# EAGLE schematic lasersupply_smd (EAGLE 5.11)
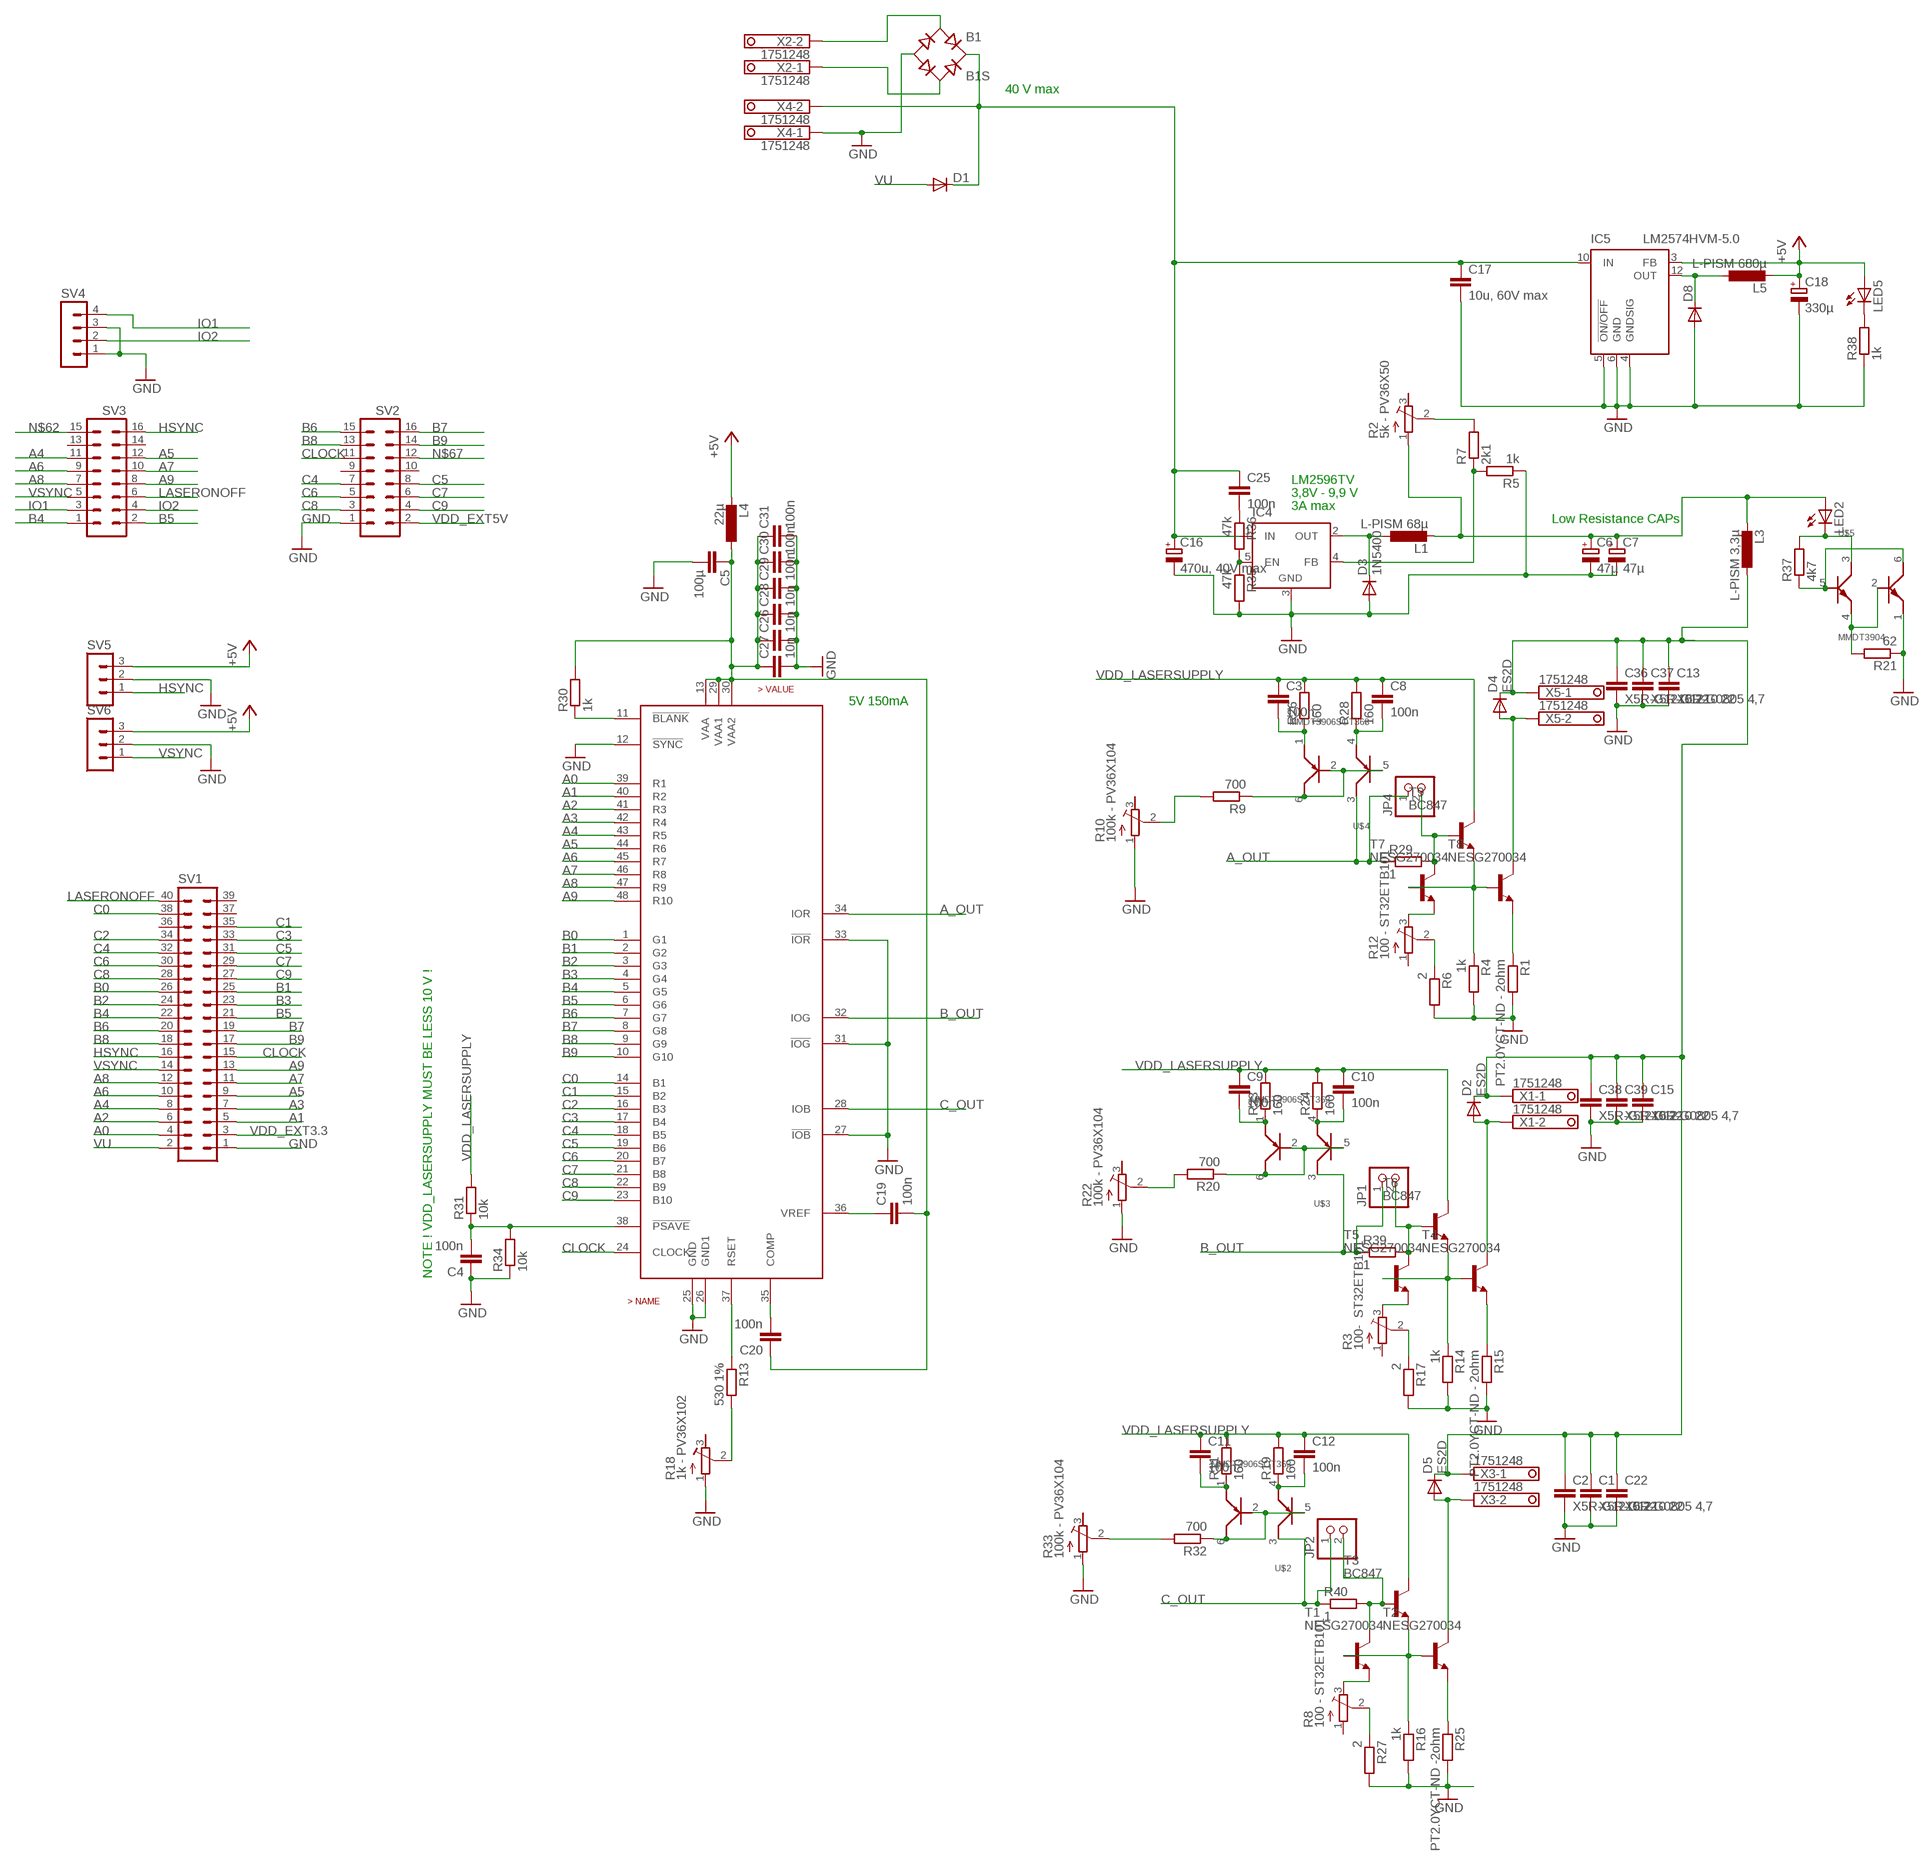
[diagram p0: schematic, sheet 1]

## Parts
B1  B1S  [MBS]
C1  X5R-G1210 22  C-EUC1210  [C1210]
C2  X5R-G1210 22  C-EUC1210  [C1210]
C3  100n  C-EUC0805  [C0805]
C4  100n  C-EUC0603  [C0603]
C5  100µ  C-EUC1210  [C1210]
C6  47µ  CPOL-EUD  [PANASONIC_D]
C7  47µ  CPOL-EUD  [PANASONIC_D]
C8  100n  C-EUC0805  [C0805]
C9  100n  C-EUC0805  [C0805]
C10  100n  C-EUC0805  [C0805]
C11  100n  C-EUC0805  [C0805]
C12  100n  C-EUC0805  [C0805]
C13  X5R-G0805 4,7  C-EUC0805  [C0805]
C15  X5R-G0805 4,7  C-EUC0805  [C0805]
C16  470u, 40V max  CPOL-EUD  [PANASONIC_D]
C17  10u, 60V max  C-EUC1210  [C1210]
C18  330µ  CPOL-EUD  [PANASONIC_D]
C19  100n  C-EUC0603  [C0603]
C20  100n  C-EUC0603  [C0603]
C22  X5R-G0805 4,7  C-EUC0805  [C0805]
C25  100n  C-EUC0805  [C0805]
C26  10n  C-EUC0603  [C0603]
C27  10n  C-EUC0603  [C0603]
C28  10n  C-EUC0603  [C0603]
C29  100n  C-EUC0603  [C0603]
C30  100n  C-EUC0603  [C0603]
C31  100n  C-EUC0603  [C0603]
C36  X5R-G1210 22  C-EUC1210  [C1210]
C37  X5R-G1210 22  C-EUC1210  [C1210]
C38  X5R-G1210 22  C-EUC1210  [C1210]
C39  X5R-G1210 22  C-EUC1210  [C1210]
D1  DIODE-SMB  [SMB]
D2  ES2D  DIODE-SOD323-R  [SOD323-R]
D3  1N5400  DIODE-SMC  [SMC]
D4  ES2D  DIODE-SOD323-R  [SOD323-R]
D5  ES2D  DIODE-SOD323-R  [SOD323-R]
D8  DIODE-SMB  [SMB]
IC4  LM2596TV  [TO220-51]
IC5  LM2574HVM-5.0  [SO14W]
JP1  PINHD-1X2  [1X02]
JP2  PINHD-1X2  [1X02]
JP4  PINHD-1X2  [1X02]
L1  L-PISM 68µ  L-EUPISM  [PISM]
L3  L-PISM 3,3µ  L-EUPIS28XX  [PIS28XX]
L4  22µ  L-EUPIS24XX  [PIS24XX]
L5  L-PISM 680µ  L-EUPISM  [PISM]
LED2  LEDCHIPLED_1206  [CHIPLED_1206]
LED5  LEDCHIPLED_1206  [CHIPLED_1206]
R1  PT2.0YCT-ND - 2ohm  R-EU_R2512  [R2512]
R2  5k - PV36X50  R-TRIMM64X  [RTRIM64X]
R3  100- ST32ETB101  TRIM_EU-SM-42/43A  [SM-42/43A]
R4  1k  R-EU_M0805  [M0805]
R5  1k  R-EU_M0805  [M0805]
R6  2  R-EU_M0805  [M0805]
R7  2k1  R-EU_M0805  [M0805]
R8  100 - ST32ETB101  TRIM_EU-SM-42/43A  [SM-42/43A]
R9  700  R-EU_M0805  [M0805]
R10  100k - PV36X104  R-TRIMM64X  [RTRIM64X]
R11  160  R-EU_R0805  [R0805]
R12  100 - ST32ETB101  TRIM_EU-SM-42/43A  [SM-42/43A]
R13  530 1%  R-EU_M0805  [M0805]
R14  1k  R-EU_M0805  [M0805]
R15  PT2.0YCT-ND - 2ohm  R-EU_R2512  [R2512]
R16  1k  R-EU_M0805  [M0805]
R17  2  R-EU_M0805  [M0805]
R18  1k - PV36X102  R-TRIMM64X  [RTRIM64X]
R19  160  R-EU_R0805  [R0805]
R20  700  R-EU_M0805  [M0805]
R21  62  R-EU_M0805  [M0805]
R22  100k - PV36X104  R-TRIMM64X  [RTRIM64X]
R23  160  R-EU_R0805  [R0805]
R24  160  R-EU_R0805  [R0805]
R25  PT2.0YCT-ND -2ohm  R-EU_R2512  [R2512]
R26  160  R-EU_R0805  [R0805]
R27  2  R-EU_R0805  [R0805]
R28  160  R-EU_R0805  [R0805]
R29  1  R-EU_R0805  [R0805]
R30  1k  R-EU_M0805  [M0805]
R31  10k  R-EU_M0805  [M0805]
R32  700  R-EU_M0805  [M0805]
R33  100k - PV36X104  R-TRIMM64X  [RTRIM64X]
R34  10k  R-EU_M0805  [M0805]
R35  47k  R-EU_M0805  [M0805]
R36  47k  R-EU_M0805  [M0805]
R37  4k7  R-EU_M0805  [M0805]
R38  1k  R-EU_M0805  [M0805]
R39  1  R-EU_R0805  [R0805]
R40  1  R-EU_R0805  [R0805]
SV1  ML40L  [ML40L]
SV2  MA08-2  [MA08-2]
SV3  MA08-2  [MA08-2]
SV4  MA04-1  [MA04-1]
SV5  MA03-1  [MA03-1]
SV6  MA03-1  [MA03-1]
T1  NESG270034  [SOT89-CEB]
T2  NESG270034  [SOT89-CEB]
T3  BC847  [SOT23]
T4  NESG270034  [SOT89-CEB]
T5  NESG270034  [SOT89-CEB]
T6  BC847  [SOT23]
T7  NESG270034  [SOT89-CEB]
T8  NESG270034  [SOT89-CEB]
T9  BC847  [SOT23]
U$1  ADV7123  [LQFP48]
U$2  MMDT3906SOT363  [SOT363_PHILIPS]
U$3  MMDT3906SOT363  [SOT363_PHILIPS]
U$4  MMDT3906SOT363  [SOT363_PHILIPS]
U$5  MMDT3904  [SOT363_PHILIPS]
X1  1751248  [1751248]
X2  1751248  [1751248]
X3  1751248  [1751248]
X4  1751248  [1751248]
X5  1751248  [1751248]

## Nets
+5V: C18.+ IC5.3(FB) L4.1 L5.2 LED5.A SV5.3 SV6.3
A0: SV1.4 U$1.39(R1)
A1: SV1.5 U$1.40(R2)
A2: SV1.6 U$1.41(R3)
A3: SV1.7 U$1.42(R4)
A4: SV1.8 SV3.11 U$1.43(R5)
A5: SV1.9 SV3.12 U$1.44(R6)
A6: SV1.10 SV3.9 U$1.45(R7)
A7: SV1.11 SV3.10 U$1.46(R8)
A8: SV1.12 SV3.7 U$1.47(R9)
A9: SV1.13 SV3.8 U$1.48(R10)
A_OUT: JP4.1 R29.1 U$1.34(IOR) U$4.3(C1)
B0: SV1.26 U$1.1(G1)
B1: SV1.25 U$1.2(G2)
B2: SV1.24 U$1.3(G3)
B3: SV1.23 U$1.4(G4)
B4: SV1.22 SV3.1 U$1.5(G5)
B5: SV1.21 SV3.2 U$1.6(G6)
B6: SV1.20 SV2.15 U$1.7(G7)
B7: SV1.19 SV2.16 U$1.8(G8)
B8: SV1.18 SV2.13 U$1.9(G9)
B9: SV1.17 SV2.14 U$1.10(G10)
B_OUT: JP1.1 R39.1 U$1.32(IOG) U$3.3(C1)
C0: SV1.38 U$1.14(B1)
C1: SV1.35 U$1.15(B2)
C2: SV1.34 U$1.16(B3)
C3: SV1.33 U$1.17(B4)
C4: SV1.32 SV2.7 U$1.18(B5)
C5: SV1.31 SV2.8 U$1.19(B6)
C6: SV1.30 SV2.5 U$1.20(B7)
C7: SV1.29 SV2.6 U$1.21(B8)
C8: SV1.28 SV2.3 U$1.22(B9)
C9: SV1.27 SV2.4 U$1.23(B10)
C_OUT: JP2.1 R40.1 U$1.28(IOB) U$2.3(C1)
CLOCK: SV1.15 SV2.11 U$1.24(CLOCK)
GND: B1.- C1.2 C2.2 C4.1 C5.2 C6.- C7.- C13.2 C15.2 C16.- C17.2 C18.- C22.2 C26.2 C27.2 C28.2 C29.2 C30.2 C31.2 C36.2 C37.2 C38.2 C39.2 D3.A D8.A IC4.3(GND) IC5.4(GNDSIG) IC5.5(!ON/OFF) IC5.6(GND) R1.2 R4.2 R5.1 R6.2 R10.1(E) R14.2 R15.2 R16.2 R17.2 R18.1(E) R21.1 R22.1(E) R25.2 R27.2 R33.1(E) R34.1 R35.2 R38.1 SV1.1 SV2.1 SV4.1 SV4.3 SV5.2 SV6.2 U$1.12(!SYNC) U$1.25(GND) U$1.26(GND1) U$1.27(!IOB) U$1.31(!IOG) U$1.33(!IOR) U$5.1(E2) X4.1
HSYNC: SV1.16 SV3.16 SV5.1
IO1: SV3.3 SV4.4
IO2: SV3.4 SV4.2
LASERONOFF: SV1.40 SV3.6
N$1: R1.1 T8.E
N$2: R30.1 U$1.11(!BLANK)
N$3: R3.3(E) T5.E
N$4: C19.1 U$1.36(VREF)
N$5: R3.2(S) R17.1
N$6: B1.AC1 X2.2
N$7: B1.AC2 X2.1
N$8: B1.+ C16.+ C17.1 C25.1 D1.C IC4.1(IN) IC5.10(IN) X4.2
N$9: IC4.4(FB) R5.2 R7.1
N$10: R4.1 T7.B T8.B T9.2(E)
N$11: C20.2 U$1.35(COMP)
N$12: R2.2(S) R7.2
N$13: R8.3(E) T1.E
N$14: R8.2(S) R27.1
N$15: D8.C IC5.12(OUT) L5.1
N$16: R9.2 R10.2(S)
N$17: D3.C IC4.2(OUT) L1.1
N$18: R12.3(E) T7.E
N$19: C11.2 R11.1 U$2.1(E2)
N$20: R15.1 T4.E
N$21: R14.1 T4.B T5.B T6.2(E)
N$22: R6.1 R12.2(S)
N$23: IC4.5(EN) R35.1 R36.2
N$24: R20.2 R22.2(S)
N$25: R32.2 R33.2(S)
N$26: R20.1 U$3.2(B2) U$3.5(B1) U$3.6(C2)
N$27: R9.1 U$4.2(B2) U$4.5(B1) U$4.6(C2)
N$28: C12.2 R19.1 U$2.4(E1)
N$29: R13.1 U$1.37(RSET)
N$30: R13.2 R18.2(S)
N$31: C9.2 R23.1 U$3.1(E2)
N$32: R16.1 T1.B T2.B T3.2(E)
N$33: C10.2 R24.1 U$3.4(E1)
N$34: C4.2 R31.1 R34.2 U$1.38(!PSAVE)
N$35: C6.+ C7.+ L1.2 L3.1 LED2.A R2.1(E)
N$36: R32.1 U$2.2(B2) U$2.5(B1) U$2.6(C2)
N$37: C5.1 C19.2 C20.1 C26.1 C27.1 C28.1 C29.1 C30.1 C31.1 L4.2 R30.2 U$1.13(VAA) U$1.29(VAA1) U$1.30(VAA2)
N$38: C3.2 R26.1 U$4.1(E2)
N$39: C8.2 R28.1 U$4.4(E1)
N$40: C25.2 R36.1
N$41: R25.1 T2.E
N$42: JP1.2 R39.2 T5.C T6.1(B)
N$43: R37.1 U$5.5(B1) U$5.6(C2)
N$44: LED2.C R37.2 U$5.3(C1)
N$45: R21.2 U$5.2(B2) U$5.4(E1)
N$46: JP4.2 R29.2 T7.C T9.1(B)
N$47: LED5.C R38.2
N$48: JP2.2 R40.2 T1.C T3.1(B)
N$56: D4.A T8.C X5.2
N$62: SV3.15
N$67: SV2.12
N$82: D2.A T4.C X1.2
N$84: D5.A T2.C X3.2
VDD_EXT3.3: SV1.3
VDD_EXT5V: SV2.2
VDD_LASERSUPPLY: C1.1 C2.1 C3.1 C8.1 C9.1 C10.1 C11.1 C12.1 C13.1 C15.1 C22.1 C36.1 C37.1 C38.1 C39.1 D2.C D4.C D5.C L3.2 R11.2 R19.2 R23.2 R24.2 R26.2 R28.2 R31.2 T3.3(C) T6.3(C) T9.3(C) X1.1 X3.1 X5.1
VSYNC: SV1.14 SV3.5 SV6.1
VU: D1.A SV1.2
Unconnected: R2.3(A) R3.1(A) R8.1(A) R10.3(A) R12.1(A) R18.3(A) R22.3(A) R33.3(A) SV1.36 SV1.37 SV1.39 SV2.9 SV2.10 SV3.13 SV3.14

## Notes on the sheet
- 40 V max
- LM2596TV
- 3,8V - 9,9 V
- 3A max
- Low Resistance CAPs
- 5V 150mA
- NOTE ! VDD_LASERSUPPLY MUST BE LESS 10 V !

## Library data of the parts
B1 = rectifier:B*S: Surface Mount Glass Passivated Bridge Rectifiers Source: Comchip Bridge Rectifiers B05S-G_B10S-G.pdf
C1-C5 C8-C13 C15 C17 C19 C20 C22 C25-C31 C36-C39 = rcl:C-EU: CAPACITOR, European symbol
C6 C7 C16 C18 = rcl:CPOL-EU: POLARIZED CAPACITOR, European symbol
D1-D5 D8 = diode:DIODE-: DIODE
IC4 = linear:LM2596T: STEP-DOWN VOLTAGE REGULATOR
IC5 = linear:LM2574?-*: SIMPLE SWITCHER 0.5A Step-Down Voltage Regulator Source: http://cache.national.com/ds/LM/LM2574.pdf
JP1 JP2 JP4 = pinhead:PINHD-1X2: PIN HEADER
L1 L3-L5 = Inductor-Fastron:L-EU
LED2 LED5 = led:LED: LED OSRAM: - CHIPLED LG R971, LG N971, LY N971, LG Q971, LY Q971, LO R971, LY R971 LH N974, LH R974 LS Q976, LO Q976, LY Q976 LO Q996 - Hyper CHIPLED LW Q18S LB Q993, LB Q99A, LB R99A - SideLED LS A670, LO A670, LY A670, LG A670, LP A670 LB A673, LV A673, LT A673, LW A673 LH A674 LY A675 LS A676, LA A676, LO A676, LY A676, LW A676 LS A679, LY A679, LG A679 - Hyper Micro SIDELED® LS Y876, LA Y876, LO Y876, LY Y876 LT Y87S - SmartLED LW L88C, LW L88S LB L89C, LB L89S, LG L890 LS L89K, LO L89K, LY L89K LS L896, LA L896, LO L896, LY L896 - TOPLED LS T670, LO T670, LY T670, LG T670, LP T670 LSG T670, LSP T670, LSY T670, LOP T670, LYG T670 LG T671, LOG T671, LSG T671 LB T673, LV T673, LT T673, LW T673 LH T674 LS T676, LA T676, LO T676, LY T676, LB T676, LH T676, LSB T676, LW T676 LB T67C, LV T67C, LT T67C, LS T67K, LO T67K, LY T67K, LW E67C LS E67B, LA E67B, LO E67B, LY E67B, LB E67C, LV E67C, LT E67C LW T67C LS T679, LY T679, LG T679 LS T770, LO T770, LY T770, LG T770, LP T770 LB T773, LV T773, LT T773, LW T773 LH T774 LS E675, LA E675, LY E675, LS T675 LS T776, LA T776, LO T776, LY T776, LB T776 LHGB T686 LT T68C, LB T68C - Hyper Mini TOPLED® LB M676 - Mini TOPLED Santana® LG M470 LS M47K, LO M47K, LY M47K Source: http://www.osram.convergy.de LUXEON: - LUMILED® LXK2-PW12-R00, LXK2-PW12-S00, LXK2-PW14-U00, LXK2-PW14-V00 LXK2-PM12-R00, LXK2-PM12-S00, LXK2-PM14-U00 LXK2-PE12-Q00, LXK2-PE12-R00, LXK2-PE12-S00, LXK2-PE14-T00, LXK2-PE14-U00 LXK2-PB12-K00, LXK2-PB12-L00, LXK2-PB12-M00, LXK2-PB14-N00, LXK2-PB14-P00, LXK2-PB14-Q00 LXK2-PR12-L00, LXK2-PR12-M00, LXK2-PR14-Q00, LXK2-PR14-R00 LXK2-PD12-Q00, LXK2-PD12-R00, LXK2-PD12-S00 LXK2-PH12-R00, LXK2-PH12-S00 LXK2-PL12-P00, LXK2-PL12-Q00, LXK2-PL12-R00 Source: www.luxeon.com KINGBRIGHT: KA-3528ASYC Source: www.kingbright.com
R1 R4 R9 R14-R17 R20 R25 R32 = resistor:R-EU_: RESISTOR, European symbol
R2 R10 R18 R22 R33 = rcl:R-TRIMM: Trimm resistor
R3 R8 R12 = pot:TRIM_EU-: POTENTIOMETER
R5-R7 R11 R13 R19 R21 R23 R24 R26-R31 R34-R40 = rcl:R-EU_: RESISTOR, European symbol
SV1 = con-ml:ML40L: HARTING; OC_FARNELL: unknown; OC_NEWARK: unknown
SV2 SV3 = con-lstb:MA08-2: PIN HEADER; OC_FARNELL: unknown; OC_NEWARK: unknown
SV4 = con-lstb:MA04-1: PIN HEADER; OC_FARNELL: unknown; OC_NEWARK: unknown
SV5 SV6 = con-lstb:MA03-1: PIN HEADER; OC_FARNELL: unknown; OC_NEWARK: unknown
T1 T2 T4 T5 T7 T8 = Labor:NESG270034: NPN TRANSISTOR
T3 T6 T9 = transistor:BC847: NPN TRANSISTOR
U$1 = Labor:ADV7123
U$2-U$4 = Labor:MMDT3906
U$5 = Labor:MMDT3904
X1-X5 = con-phoenix-350:1751248: MKDS 1/ 2-3,5 Printklemme Nennstrom: 10 A Bemessungsspannung: 160 V Raster: 3,5 mm Polzahl: 2 Montageart: Löten Anschlussart: Schraubanschluss Anschlussrichtung vom Leiter zur Platine: 0° Source: http://eshop.phoenixcontact.com .. 1751248.pdf